# Altium schematic sheet MODULE.SchDoc
size 420 x 297 mm; SheetNumber: 1; SheetTotal: 1
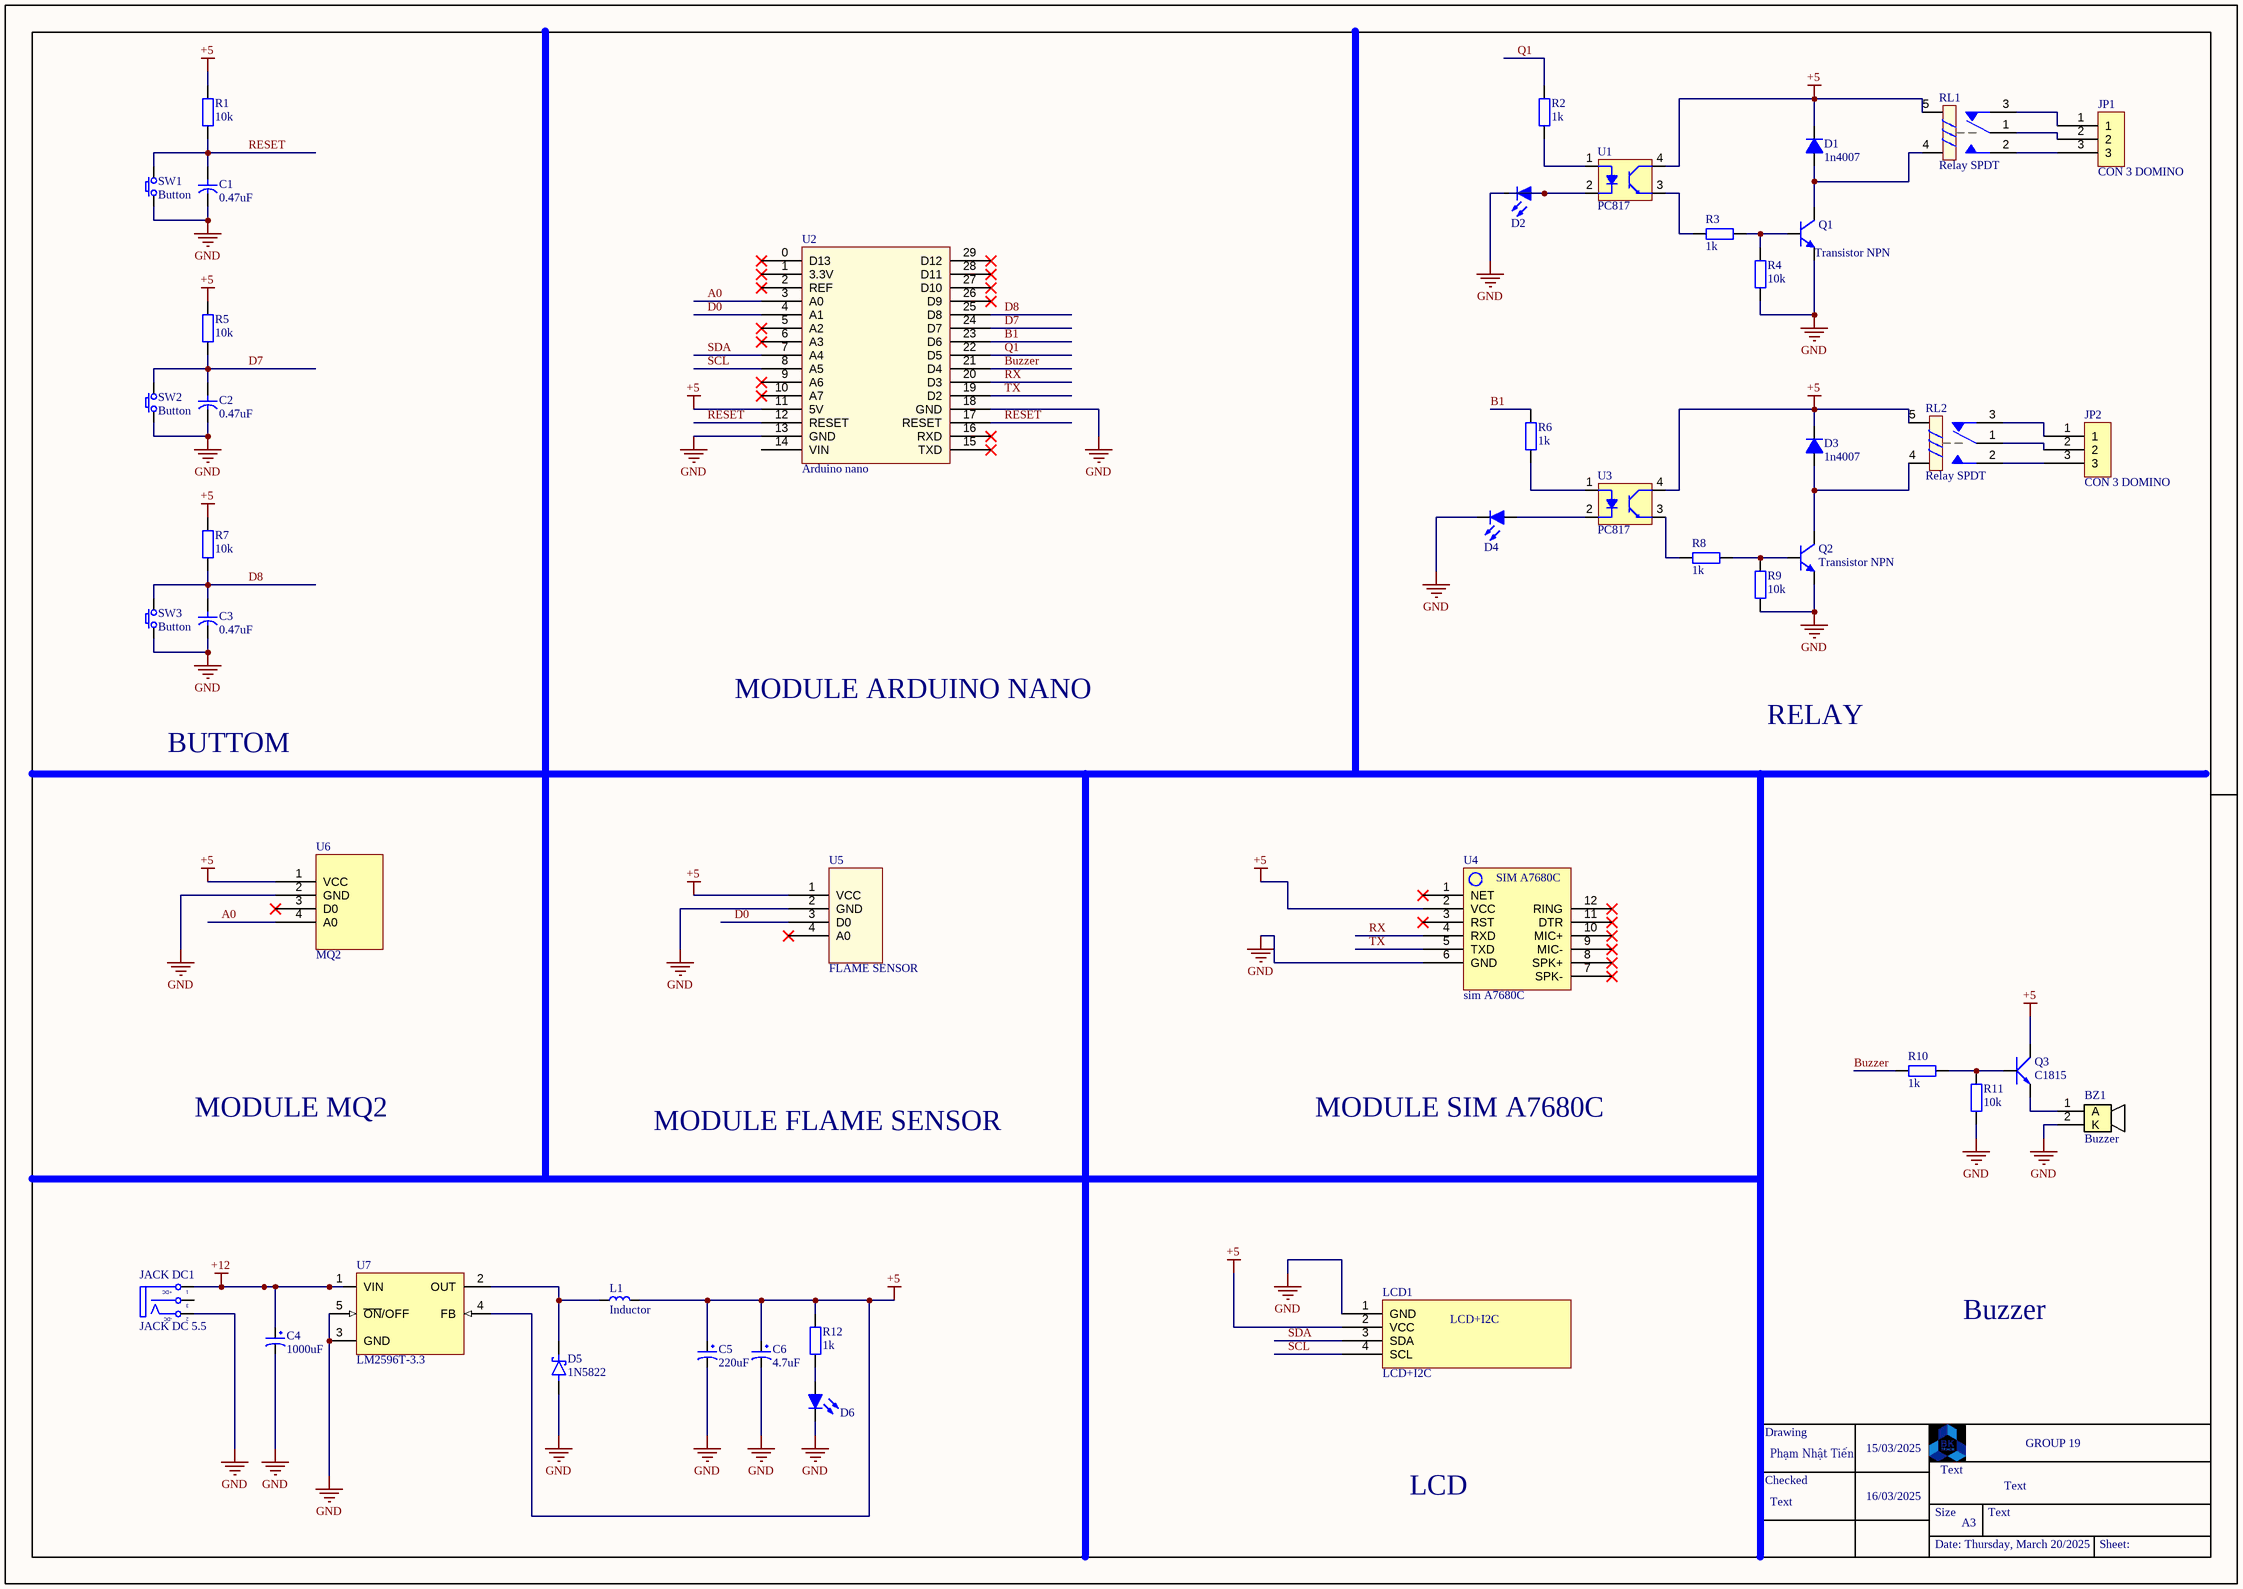
[diagram p0: MODULE.SchDoc]

## Parts
BZ1  Buzzer  [BUZZER-2]
C1  0.47uF  [CYL/D.250/LS.100]
C2  0.47uF  [CYL/D.250/LS.100]
C3  0.47uF  [CYL/D.250/LS.100]
C4  1000uF  [tu hoa 13mm]
C5  220uF  [tu hoa 10mm]
C6  4.7uF  [tu hoa 5mm]
D1  1n4007  [DIODE 1A]
D2  Led  [LED 5MM - RED]  (value not drawn)
D3  1n4007  [DIODE 1A]
D4  Led  [LED 5MM - RED]  (value not drawn)
D5  1N5822  [1N5822]
D6  Led  [LED 5MM - RED]  (value not drawn)
JACK_DC1  JACK DC 5.5  [JACK DC 5.5]
JP1  CON 3 DOMINO  [CON 3]
JP2  CON 3 DOMINO  [CON 3]
L1  Inductor  [L/D9H12]
LCD1  LCD+I2C  [LCD+I2C]
Q1  Transistor NPN  [TO-92/W100]
Q2  Transistor NPN  [TO-92/W100]
Q3  C1815  [TO92]
R1  10k  [tro vach 1/4w]
R2  1k  [tro vach 1/4w]
R3  1k  [tro vach 1/4w]
R4  10k  [tro vach 1/4w]
R5  10k  [tro vach 1/4w]
R6  1k  [tro vach 1/4w]
R7  10k  [tro vach 1/4w]
R8  1k  [tro vach 1/4w]
R9  10k  [tro vach 1/4w]
R10  1k  [tro vach 1/4w]
R11  10k  [tro vach 1/4w]
R12  1k  [tro vach 1/4w]
RL1  Relay SPDT  [RL_SPDT_10A]
RL2  Relay SPDT  [RL_SPDT_10A]
SW1  Button  [SW/2/DIP]
SW2  Button  [SW/2/DIP]
SW3  Button  [SW/2/DIP]
U1  PC817  [DIP4 - PC817]
U2  Arduino nano  [Arduino nano]
U3  PC817  [DIP4 - PC817]
U4  sim A7680C  [SIM A7680C]
U5  FLAME SENSOR  [FLAME SENSOR]
U6  MQ2  [MQ2]
U7  LM2596T-3.3  [T05D]

## Nets
+5: C5.1 C6.1 D1.2(K) D3.2(K) L1.2 LCD1.2(VCC) Q3.2(C) R1.2 R5.2 R7.2 R12.2 RL1.5(COIL2) RL2.5(COIL2) U1.4(C) U2.11(5V) U3.4(C) U4.2(VCC) U5.1(VCC) U6.1(VCC) U7.4(FB)
+12: C4.1 JACK_DC1.1(T) U7.1(VIN)
GND: BZ1.2(K) C1.2 C2.2 C3.2 C4.2 C5.2 C6.2 D2.2(K) D4.2(K) D5.1(A) D6.2(K) JACK_DC1.2(TN) LCD1.1(GND) Q1.2(E) Q2.2(E) R4.1 R9.1 R11.1 SW1.1 SW2.1 SW3.1 U2.13(GND) U2.18(GND) U4.6(GND) U5.2(GND) U6.2(GND) U7.3(GND) U7.5(~{ON}/OFF)
A0: U2.3(A0) U6.4(A0)
B1: R6.2 U2.23(D6)
Buzzer: R10.1 U2.21(D4)
D0: U2.4(A1) U5.3(D0)
D7: C2.1 R5.1 SW2.2 U2.24(D7)
D8: C3.1 R7.1 SW3.2 U2.25(D8)
Q1: R2.2 U2.22(D5)
RESET: C1.1 R1.1 SW1.2 U2.12(RESET) U2.17(RESET)
RX: U2.20(D3) U4.4(RXD)
SCL: LCD1.4(SCL) U2.8(A5)
SDA: LCD1.3(SDA) U2.7(A4)
TX: U2.19(D2) U4.5(TXD)
NetBZ1_1: BZ1.1(A) Q3.1(E)
NetD1_1: D1.1(A) Q1.3(C) RL1.4(COIL1)
NetD2_1: D2.1(A) U1.2(K)
NetD3_1: D3.1(A) Q2.3(C) RL2.4(COIL1)
NetD4_1: D4.1(A) U3.2(K)
NetD5_2: D5.2(K) L1.1 U7.2(OUT)
NetD6_1: D6.1(A) R12.1
NetJP1_1: JP1.1 RL1.3(NC)
NetJP1_2: JP1.2 RL1.1(COM)
NetJP1_3: JP1.3 RL1.2(NO)
NetJP2_1: JP2.1 RL2.3(NC)
NetJP2_2: JP2.2 RL2.1(COM)
NetJP2_3: JP2.3 RL2.2(NO)
NetQ1_1: Q1.1(B) R3.2 R4.2
NetQ2_1: Q2.1(B) R8.2 R9.2
NetQ3_3: Q3.3(B) R10.2 R11.2
NetR2_1: R2.1 U1.1(A)
NetR3_1: R3.1 U1.3(E)
NetR6_1: R6.1 U3.1(A)
NetR8_1: R8.1 U3.3(E)

Not connected (* = marked no-connect by the designer): JACK_DC1 3(S); U2 0(D13)* 1(3.3V)* 2(REF)* 5(A2)* 6(A3)* 9(A6)* 10(A7)* 14(VIN) 15(TXD)* 16(RXD)* 26(D9)* 27(D10)* 28(D11)* 29(D12)*; U4 1(NET)* 3(RST)* 7(SPK-)* 8(SPK+)* 9(MIC-)* 10(MIC+)* 11(DTR)* 12(RING)*; U5 4(A0)*; U6 3(D0)*

## Notes on the sheet
- MODULE ARDUINO NANO
- RELAY
- BUTTOM
- MODULE MQ2
- MODULE FLAME SENSOR
- MODULE SIM A7680C
- Buzzer
- LCD
- Drawing
- Phạm Nhật Tiến
- 15/03/2025
- Text
- GROUP 19
- Checked
- 16/03/2025
- Size
- A3
- Date: Thursday, March 20/2025
- Sheet:
- (in symbol JACK DC 5.5) +DC; -DC
- (in symbol sim A7680C) SIM A7680C

## Library data of the parts
C1-C3 = Capacitor: Capacitor pol
C4 = Tu Hoa 1000uF 50V 13x26: Cắm; Don_Vi: Con; So_Chan: 2; Ten_Linh_Kien: Tụ Hóa 1000uF 50V; Ma_Hang: MH006619; Chung_Loai: Cắm; Kieu_Chan: *
C5 = Tu Hoa 220uF 50V 10x14: Cắm; Don_Vi: Con; So_Chan: 2; Ten_Linh_Kien: Tụ Hóa 220uF 50V; Ma_Hang: MH006873; Chung_Loai: Cắm; Kieu_Chan: *
C6 = Tu Hoa 0.47uF 50V 5x11: Cắm; Don_Vi: Con; So_Chan: 2; Ten_Linh_Kien: Tụ Hóa 0.47uF50V 5x11MM; Ma_Hang: MH006969; Chung_Loai: Cắm; Kieu_Chan: *
D1 D3 = Diode 1N4007: Cắm; Ten_Linh_Kien: Diode 1N4007 1A (DIP); Don_Vi: Con; Ma_Hang: MH001063; Ghi Chu: *; Kieu_Chan: *; Chung_Loai: Cắm
D2 D4 D6 = Led: Typical LED
JACK_DC1 = JACK DC 5.5: Value: Jac DC
Q1 Q2 = Transistor NPN: NPN Bipolar Transistor; pin to pad: 1>3 2>1 3>2
Q3 = Trans C1815 DIP: NPN transistor; Value: C9014
R1 R5 R7 R11 = Tro Vach 1/4W 5% 10k: Căm; Chung_Loai: Cắm; Don_Vi: Con; So_Chan: 2; Ten_Linh_Kien: Trở Vạch 1/4w 5% 10K; Ma_Hang: MH007354; Kieu_Chan: *
R2 R3 R6 R8 R12 = Tro Vach 1/4W 5% 1k: Cắm; Don_Vi: Con; So_Chan: 2; Ten_Linh_Kien: Trở Vạch 1/4w 5% 1k; Ma_Hang: MH007390; Chung_Loai: Cắm; Kieu_Chan: *
R4 R9 = Tro Vach 1/4W 1% 10k: Cắm; Don_Vi: Con; So_Chan: 2; Ten_Linh_Kien: Trở Vạch 1/4w 1% 10k; Ma_Hang: MH006349; Chung_Loai: Cắm; Kieu_Chan: *
R10 = Tro Vach 1/4W 5% 1R: Cắm; Don_Vi: Con; So_Chan: 2; Ten_Linh_Kien: Trở Vạch 1/4w 5% 1R; Ma_Hang: MH007394; Chung_Loai: Cắm; Kieu_Chan: *
SW1-SW3 = SW SPST: Tact switch 2 pin
U1 U3 = PC817: Opto PC817B
U7 = CMP-0069-01929-2: SIMPLE SWITCHER® Power Converter 150 KHz 3A Step-Down Voltage Regulator, 5-pin TO-220; Manufacturer: National Semiconductor; PackageTopMarking: NSUZXYTTE#*LM2596T*-3.3 P+; PowerWise: N; CompType: Switcher; ComponentLink1URL: http://www.national.com/ds/LM/LM2596.pdf; ComponentLink2URL: http://www.national.com/pf/LM/LM2596.html; RoHS: N; RevisionNote: Component URLs added; PackageVersion: revA, Oct-1989; ComponentLink1Description: LM2596 Datasheet; DatasheetVersion: May-2002; ComponentLink3URL: http://www.national.com/packaging/folders/t05d.html; PackageDescription: TO-220, Molded, Stagger Bend, 5 Lead; ComponentLink3Description: T05D Package Page; PackageReference: T05D; PinCount: 5; ComponentLink2Description: LM2596 Web Page